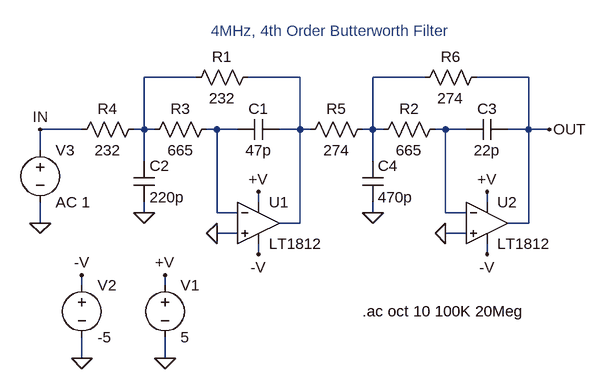
[diagram p0: schematic 1812.asc]
1812.asc, the LTspice schematic file:
Version 4
SHEET 1 896 680
WIRE 96 16 16 16
WIRE 256 16 176 16
WIRE 448 16 368 16
WIRE 608 16 528 16
WIRE -80 96 -144 96
WIRE 16 96 16 16
WIRE 16 96 0 96
WIRE 32 96 16 96
WIRE 128 96 112 96
WIRE 160 96 128 96
WIRE 256 96 256 16
WIRE 256 96 224 96
WIRE 272 96 256 96
WIRE 368 96 368 16
WIRE 368 96 352 96
WIRE 384 96 368 96
WIRE 480 96 464 96
WIRE 512 96 480 96
WIRE 608 96 608 16
WIRE 608 96 576 96
WIRE 640 96 608 96
WIRE -144 128 -144 96
WIRE 16 144 16 96
WIRE 368 144 368 96
WIRE 192 208 192 192
WIRE 544 208 544 192
WIRE 16 224 16 208
WIRE 128 224 128 96
WIRE 160 224 128 224
WIRE 368 224 368 208
WIRE 480 224 480 96
WIRE 512 224 480 224
WIRE -144 240 -144 208
WIRE 256 240 256 96
WIRE 256 240 224 240
WIRE 608 240 608 96
WIRE 608 240 576 240
WIRE 160 256 128 256
WIRE 512 256 480 256
WIRE 192 288 192 272
WIRE 544 288 544 272
WIRE -80 336 -80 320
WIRE 48 336 48 320
WIRE -80 448 -80 416
WIRE 48 448 48 416
FLAG 48 448 0
FLAG 192 192 +V
FLAG 48 320 +V
FLAG 192 288 -V
FLAG -80 448 0
FLAG -80 320 -V
FLAG 16 224 0
FLAG 128 256 0
FLAG 544 192 +V
FLAG 544 288 -V
FLAG 368 224 0
FLAG 480 256 0
FLAG -144 96 IN
FLAG 640 96 OUT
FLAG -144 240 0
SYMBOL voltage 48 320 R0
SYMATTR InstName V1
SYMATTR Value 5
SYMBOL voltage -80 320 R0
SYMATTR InstName V2
SYMATTR Value -5
SYMBOL opamps\\LT1812 192 176 R0
SYMATTR InstName U1
SYMBOL cap 224 80 R90
WINDOW 0 0 32 VBottom 0
WINDOW 3 32 32 VTop 0
SYMATTR InstName C1
SYMATTR Value 47p
SYMBOL res 128 80 R90
WINDOW 0 0 56 VBottom 0
WINDOW 3 32 56 VTop 0
SYMATTR InstName R3
SYMATTR Value 665
SYMBOL res 16 80 R90
WINDOW 0 0 56 VBottom 0
WINDOW 3 32 56 VTop 0
SYMATTR InstName R4
SYMATTR Value 232
SYMBOL res 192 0 R90
WINDOW 0 0 56 VBottom 0
WINDOW 3 32 56 VTop 0
SYMATTR InstName R1
SYMATTR Value 232
SYMBOL cap 0 144 R0
SYMATTR InstName C2
SYMATTR Value 220p
SYMBOL opamps\\LT1812 544 176 R0
SYMATTR InstName U2
SYMBOL cap 576 80 R90
WINDOW 0 0 32 VBottom 0
WINDOW 3 32 32 VTop 0
SYMATTR InstName C3
SYMATTR Value 22p
SYMBOL res 480 80 R90
WINDOW 0 0 56 VBottom 0
WINDOW 3 32 56 VTop 0
SYMATTR InstName R2
SYMATTR Value 665
SYMBOL res 368 80 R90
WINDOW 0 0 56 VBottom 0
WINDOW 3 32 56 VTop 0
SYMATTR InstName R5
SYMATTR Value 274
SYMBOL res 544 0 R90
WINDOW 0 0 56 VBottom 0
WINDOW 3 32 56 VTop 0
SYMATTR InstName R6
SYMATTR Value 274
SYMBOL cap 352 144 R0
SYMATTR InstName C4
SYMATTR Value 470p
SYMBOL voltage -144 112 R0
SYMATTR InstName V3
SYMATTR Value AC 1
TEXT 352 376 Left 0 !.ac oct 10 100K 20Meg
TEXT 304 -40 Bottom 0 ;4MHz, 4th Order Butterworth Filter

The netlist it stands for:
* 1812.asc
V1 +V 0 5
V2 -V 0 -5
XU1 0 N004 +V -V N002 LT1812  ; pins In+ In- V+ V- OUT
C1 N002 N004 47p
R3 N004 N001 665
R4 N001 IN 232
R1 N002 N001 232
C2 N001 0 220p
XU2 0 N005 +V -V OUT LT1812  ; pins In+ In- V+ V- OUT
C3 OUT N005 22p
R2 N005 N003 665
R5 N003 N002 274
R6 OUT N003 274
C4 N003 0 470p
V3 IN 0 AC 1
.ac oct 10 100K 20Meg
* 4MHz, 4th Order Butterworth Filter
.backanno
.end